# EAGLE design main (EAGLE 4.09)
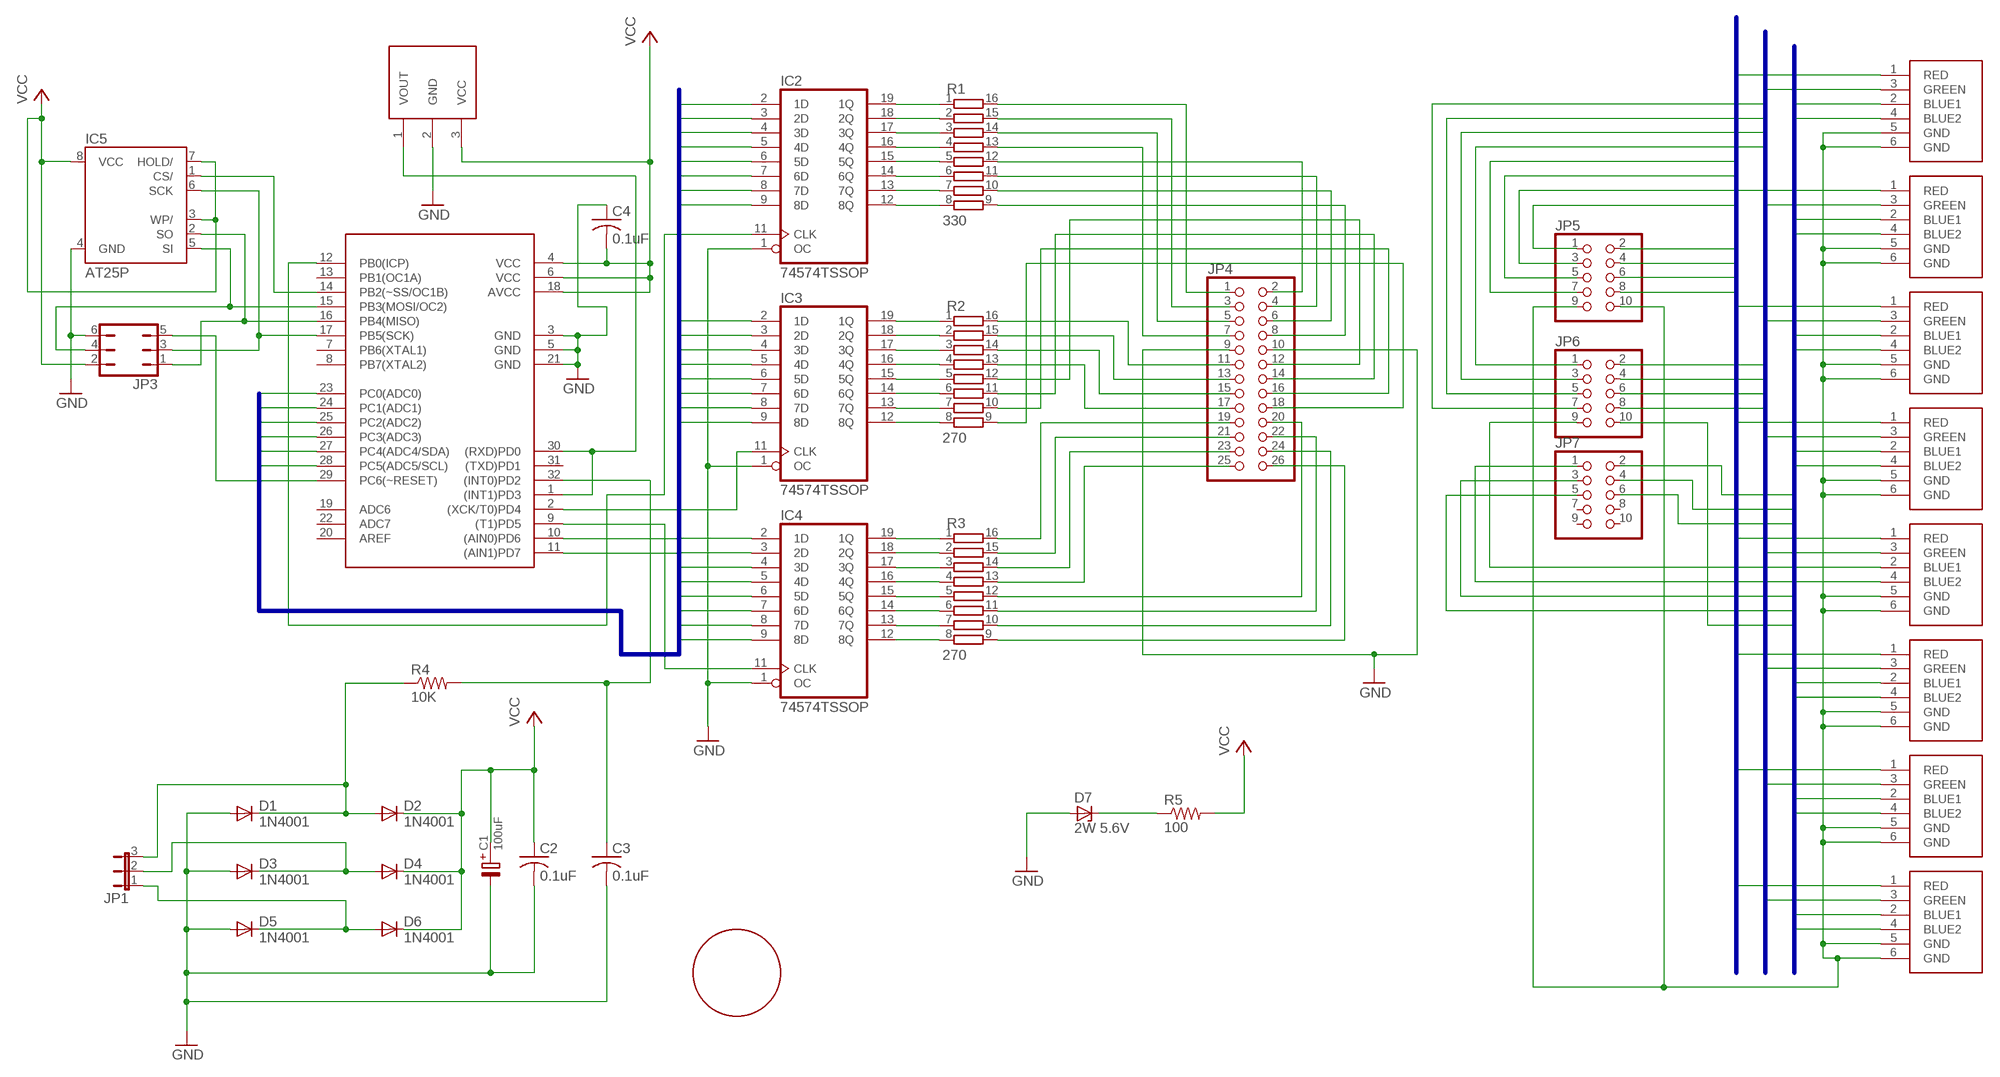
[diagram p0: schematic, sheet 1]

## Parts
C1  100uF  E2,0-5  [E2,0-5]
C2  0.1uF  C-USC1206  [C1206]
C3  0.1uF  C-USC1206  [C1206]
C4  0.1uF  C-USC1206  [C1206]
D1  1N4001  1N4004  [DO41-10]
D2  1N4001  1N4004  [DO41-10]
D3  1N4001  1N4004  [DO41-10]
D4  1N4001  1N4004  [DO41-10]
D5  1N4001  1N4004  [DO41-10]
D6  1N4001  1N4004  [DO41-10]
D7  2W 5.6V  1N4728  [DO41Z10]
GEAR  GEAR-T30  [GEAR-T30]
IC1  ATMEGA8  MEGA8A  [TQFP32]
IC2  74574TSSOP  74574PW  [TSSOP-20]
IC3  74574TSSOP  74574PW  [TSSOP-20]
IC4  74574TSSOP  74574PW  [TSSOP-20]
IC5  AT25P  [DIL08]
JP1  JP2E  [JP2]
JP3  JP3Q  [JP3Q]
JP4  PINHD-2X13  [2X13]
JP5  PINHD-2X5  [2X05]
JP6  PINHD-2X5  [2X05]
JP7  PINHD-2X5  [2X05]
LED0  LF819  [10MM-6]
LED1  LF819  [10MM-6]
LED2  LF819  [10MM-6]
LED3  LF819  [10MM-6]
LED4  LF819  [10MM-6]
LED5  LF819  [10MM-6]
LED6  LF819  [10MM-6]
LED7  LF819  [10MM-6]
Q1  PNA46XXM  [SIP-3]
R1  330  4816P-T01  [4816P]
R2  270  4816P-T01  [4816P]
R3  270  4816P-T01  [4816P]
R4  10K  R-US_R1206  [R1206]
R5  100  R-US_R1206  [R1206]

## Nets
ARM-GND: JP5.9 JP5.10 LED0.5(GND) LED0.6(GND) LED1.5(GND) LED1.6(GND) LED2.5(GND) LED2.6(GND) LED3.5(GND) LED3.6(GND) LED4.5(GND) LED4.6(GND) LED5.5(GND) LED5.6(GND) LED6.5(GND) LED6.6(GND) LED7.5(GND) LED7.6(GND)
B0: JP6.9 LED0.2(BLUE1) LED0.4(BLUE2)
B0-B: JP4.19 R3.16
B1: JP7.1 LED1.2(BLUE1) LED1.4(BLUE2)
B1-B: JP4.21 R3.15
B2: JP7.3 LED2.2(BLUE1) LED2.4(BLUE2)
B2-B: JP4.23 R3.14
B3: JP7.5 LED3.2(BLUE1) LED3.4(BLUE2)
B3-B: JP4.25 R3.13
B4: JP6.10 LED4.2(BLUE1) LED4.4(BLUE2)
B4-B: JP4.20 R3.12
B5: JP7.2 LED5.2(BLUE1) LED5.4(BLUE2)
B5-B: JP4.22 R3.11
B6: JP7.4 LED6.2(BLUE1) LED6.4(BLUE2)
B6-B: JP4.24 R3.10
B7: JP7.6 LED7.2(BLUE1) LED7.4(BLUE2)
B7-B: JP4.26 R3.9
BPRE0: IC4.19(1Q) R3.1
BPRE1: IC4.18(2Q) R3.2
BPRE2: IC4.17(3Q) R3.3
BPRE3: IC4.16(4Q) R3.4
BPRE4: IC4.15(5Q) R3.5
BPRE5: IC4.14(6Q) R3.6
BPRE6: IC4.13(7Q) R3.7
BPRE7: IC4.12(8Q) R3.8
COMM-DATA: IC1.1((INT1)PD3) IC1.30((RXD)PD0) Q1.1(VOUT)
D0: IC1.23(PC0(ADC0)) IC2.2(1D) IC3.2(1D) IC4.2(1D)
D1: IC1.24(PC1(ADC1)) IC2.3(2D) IC3.3(2D) IC4.3(2D)
D2: IC1.25(PC2(ADC2)) IC2.4(3D) IC3.4(3D) IC4.4(3D)
D3: IC1.26(PC3(ADC3)) IC2.5(4D) IC3.5(4D) IC4.5(4D)
D4: IC1.27(PC4(ADC4/SDA)) IC2.6(5D) IC3.6(5D) IC4.6(5D)
D5: IC1.28(PC5(ADC5/SCL)) IC2.7(6D) IC3.7(6D) IC4.7(6D)
D6: IC1.10((AIN0)PD6) IC2.8(7D) IC3.8(7D) IC4.8(7D)
D7: IC1.11((AIN1)PD7) IC2.9(8D) IC3.9(8D) IC4.9(8D)
G0: JP6.1 LED0.3(GREEN)
G0-B: JP4.11 R2.16
G1: JP6.3 LED1.3(GREEN)
G1-B: JP4.13 R2.15
G2: JP6.5 LED2.3(GREEN)
G2-B: JP4.15 R2.14
G3: JP6.7 LED3.3(GREEN)
G3-B: JP4.17 R2.13
G4: JP6.2 LED4.3(GREEN)
G4-B: JP4.12 R2.12
G5: JP6.4 LED5.3(GREEN)
G5-B: JP4.14 R2.11
G6: JP6.6 LED6.3(GREEN)
G6-B: JP4.16 R2.10
G7: JP6.8 LED7.3(GREEN)
G7-B: JP4.18 R2.9
GND: C1.- C2.2 C3.2 C4.1 D1.A D3.A D5.A D7.A IC1.3(GND) IC1.5(GND) IC1.21(GND) IC2.1(OC) IC3.1(OC) IC4.1(OC) IC5.4(GND) JP3.6 JP4.9 JP4.10 Q1.2(GND)
GPRE0: IC3.19(1Q) R2.1
GPRE1: IC3.18(2Q) R2.2
GPRE2: IC3.17(3Q) R2.3
GPRE3: IC3.16(4Q) R2.4
GPRE4: IC3.15(5Q) R2.5
GPRE5: IC3.14(6Q) R2.6
GPRE6: IC3.13(7Q) R2.7
GPRE7: IC3.12(8Q) R2.8
MISO: IC1.16(PB4(MISO)) IC5.2(SO) JP3.1
MOSI: IC1.15(PB3(MOSI/OC2)) IC5.5(SI) JP3.4
N$1: D7.C R5.1
R0: JP5.1 LED0.1(RED)
R0-B: JP4.1 R1.16
R1: JP5.3 LED1.1(RED)
R1-B: JP4.3 R1.15
R2: JP5.5 LED2.1(RED)
R2-B: JP4.5 R1.14
R3: JP5.7 LED3.1(RED)
R3-B: JP4.7 R1.13
R4: JP5.2 LED4.1(RED)
R4-B: JP4.2 R1.12
R5: JP5.4 LED5.1(RED)
R5-B: JP4.4 R1.11
R6: JP5.6 LED6.1(RED)
R6-B: JP4.6 R1.10
R7: JP5.8 LED7.1(RED)
R7-B: JP4.8 R1.9
RESET: IC1.29(PC6(~RESET)) JP3.5
RPRE0: IC2.19(1Q) R1.1
RPRE1: IC2.18(2Q) R1.2
RPRE2: IC2.17(3Q) R1.3
RPRE3: IC2.16(4Q) R1.4
RPRE4: IC2.15(5Q) R1.5
RPRE5: IC2.14(6Q) R1.6
RPRE6: IC2.13(7Q) R1.7
RPRE7: IC2.12(8Q) R1.8
SCK: IC1.17(PB5(SCK)) IC5.6(SCK) JP3.3
SS: IC1.14(PB2(~SS/OC1B)) IC5.1(CS/)
STROBE_BLUE: IC1.9((T1)PD5) IC4.11(CLK)
STROBE_FRAME: C3.1 IC1.32((INT0)PD2) R4.2
STROBE_GREEN: IC1.2((XCK/T0)PD4) IC3.11(CLK)
STROBE_RED: IC1.12(PB0(ICP)) IC2.11(CLK)
VCC: C1.+ C2.1 C4.2 D2.C D4.C D6.C IC1.4(VCC) IC1.6(VCC) IC1.18(AVCC) IC5.3(WP/) IC5.7(HOLD/) IC5.8(VCC) JP3.2 Q1.3(VCC) R5.2
VIN-PHASE1: D5.C D6.A JP1.1
VIN-PHASE2: D3.C D4.A JP1.2
VIN_PHASE3: D1.C D2.A JP1.3 R4.1
Unconnected: IC1.7(PB6(XTAL1)) IC1.8(PB7(XTAL2)) IC1.13(PB1(OC1A)) IC1.19(ADC6) IC1.20(AREF) IC1.22(ADC7) IC1.31((TXD)PD1) JP7.7 JP7.8 JP7.9 JP7.10

## Buses
D[0..7]
R[0..7]
G[0..7]
B[0..7]

## Power pins joined to a net without a drawn wire
GND: IC2.10(GND) IC3.10(GND) IC4.10(GND)
VCC: IC2.20(VCC) IC3.20(VCC) IC4.20(VCC)

## Library data of the parts
C1 = cap-pan:E2,0-5
C2-C4 = rcl:C-US: CAPACITOR, American symbol
D1-D6 = diode:1N4004: DIODE general purpose rectifier, 1 A
D7 = diode:1N4728: Z DIODE 3.3 V, 1W, 5 percent
GEAR = spin:GEAR-T30
IC1 = atmel:MEGA8*: MICROCONTROLLER 8 Kbytes FLASH 1024 bytes SRAM 512 bytes EEPROM USART 8-channel 10 bit ADC
IC2-IC4 = 74xx-us:74*574: 8-bit D type FLIP FLOP bus driver
IC5 = atmel:AT25*: SPI bus serial EEPROM
JP1 = jumper:JP2E: JUMPER
JP3 = jumper:JP3Q: JUMPER
JP4 = pinhead:PINHD-2X13: PIN HEADER
JP5-JP7 = pinhead:PINHD-2X5: PIN HEADER
LED0 LED1-LED7 = kingbright:LF819: Full-color LED, 10MM
Q1 = spin:PNA46XXM
R1-R3 = resistor-bourns:4816P-T01: BOURNS RESISTOR NETWORK
R4 R5 = rcl:R-US_: RESISTOR, American symbol

## Board
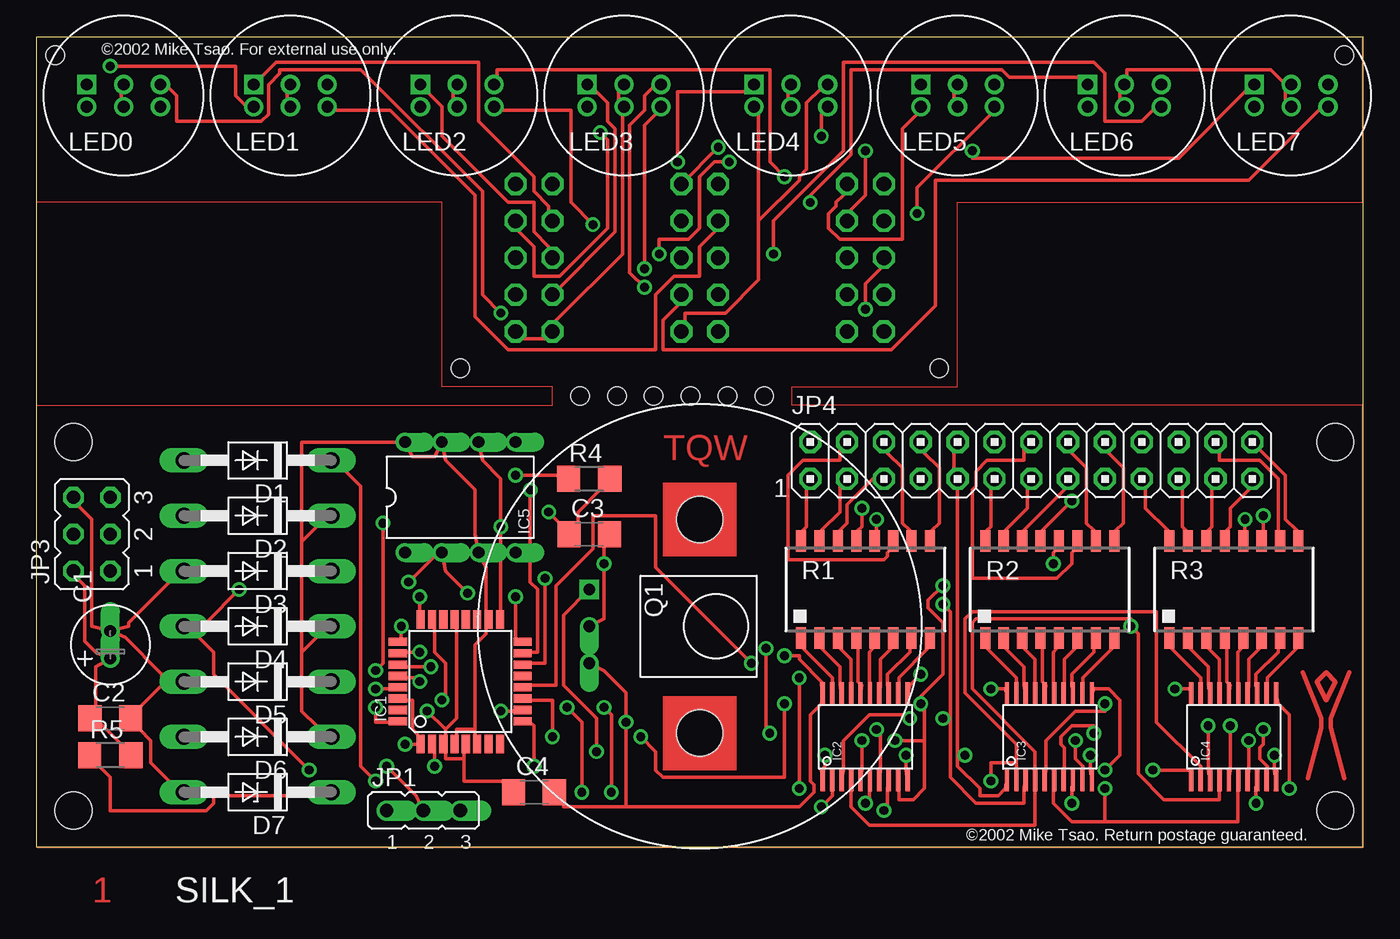
[diagram p1: board, top side]
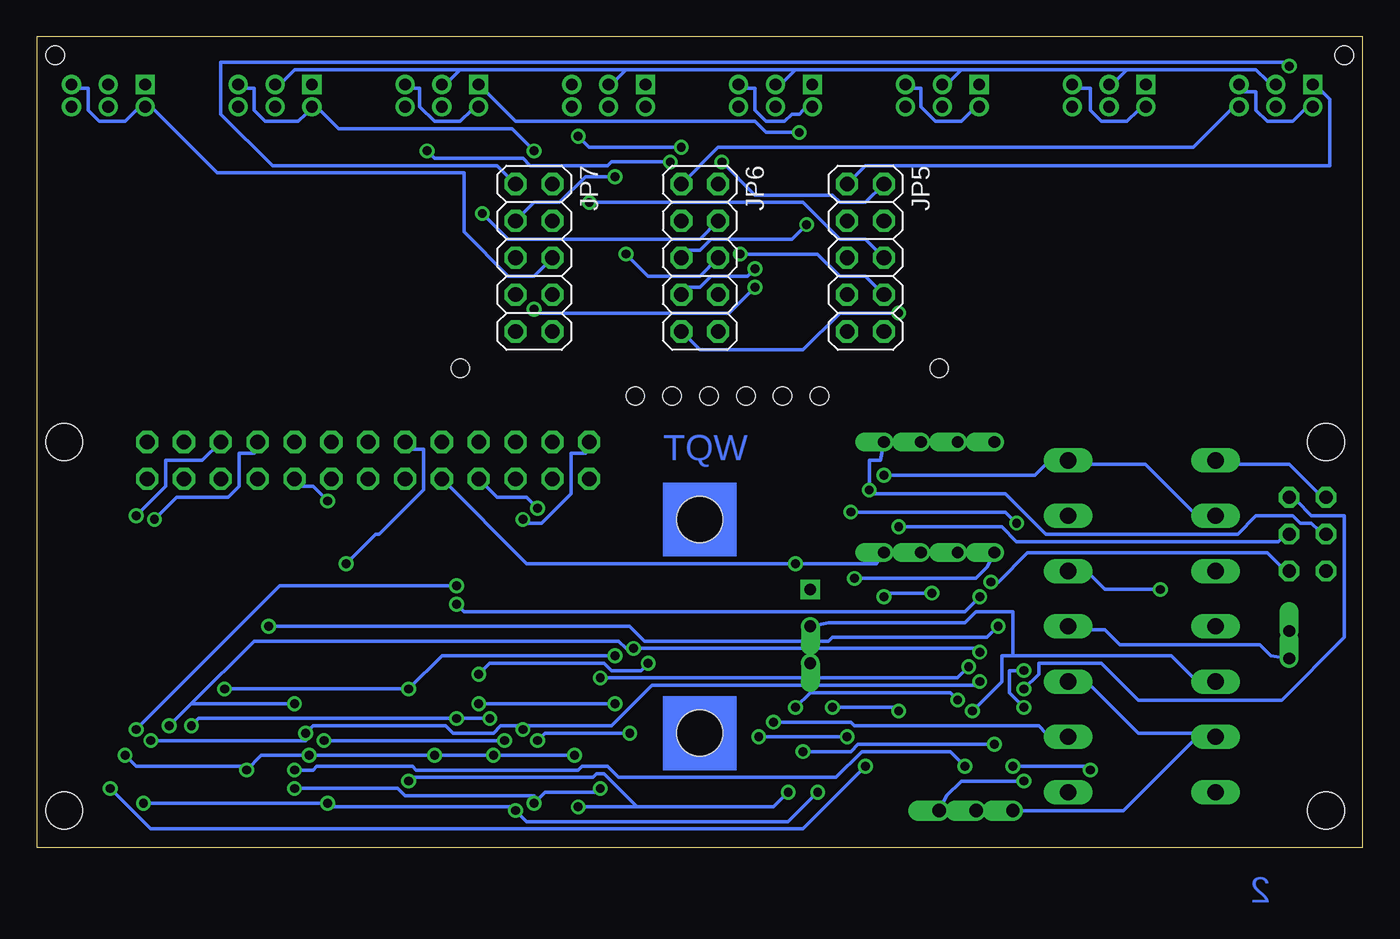
[diagram p2: board, bottom side, seen from below]

Size 91.44 x 55.88 mm. Coordinates in mm from the lower left corner, seen from the top.
Outline: 0,55.88 91.44,55.88 91.44,0 0,0 0,55.88
Copper layers used: Top, Bottom
Holes 1.27 mm at 1.27,54.61 90.17,54.61 50.16,31.11 47.62,31.11 45.09,31.11 42.55,31.11 40.01,31.11 37.47,31.11 29.21,33.02 62.23,33.02
Holes 2.54 mm at 2.54,27.94 2.54,2.54 89.53,2.54 89.53,27.94
tRestrict: area -1.3,29.2 to 91.4,33; area -1.3,35.6 to 29.2,45.7; area 62.2,36.8 to 92.7,45.7
bRestrict: area -1.3,29.2 to 91.4,33; area -1.3,35.6 to 29.2,45.7; area 62.2,36.8 to 92.7,45.7
vRestrict: area -1.3,29.2 to 91.4,33; area 62.2,0 to 87.6,1.3; area -1.3,35.6 to 29.2,45.7; area 62.2,36.8 to 92.7,45.7

### Footprints (pad centres in the part's own frame; a part is rotated, then mirrored left to right if it is on the bottom)
E2,0-5 = drill 0.813 pad 1.27 offset: + -0.953,0; - 0.953,0
C1206 = smd 1.6 x 1.8: 1 -1.4,0; 2 1.4,0
DO41-10 = drill 1.118 long: A 5.08,0; C -5.08,0
DO41Z10 = drill 1.118 long: A 5.08,0; C -5.08,0
GEAR-T30 = hole 3.175: 0,7.366; 0,-7.366
TQFP32 = smd 1.27 x 0.559: 1 -4.293,2.743; 2 -4.293,1.956; 3 -4.293,1.168; 4 -4.293,0.381; 5 -4.293,-0.381; 6 -4.293,-1.168; 7 -4.293,-1.956; 8 -4.293,-2.743; 17 4.293,-2.743; 18 4.293,-1.956; 19 4.293,-1.168; 20 4.293,-0.381; 21 4.293,0.381; 22 4.293,1.168; 23 4.293,1.956; 24 4.293,2.743 | smd 0.559 x 1.27: 9 -2.743,-4.293; 10 -1.956,-4.293; 11 -1.168,-4.293; 12 -0.381,-4.293; 13 0.381,-4.293; 14 1.168,-4.293; 15 1.956,-4.293; 16 2.743,-4.293; 25 2.743,4.293; 26 1.956,4.293; 27 1.168,4.293; 28 0.381,4.293; 29 -0.381,4.293; 30 -1.168,4.293; 31 -1.956,4.293; 32 -2.743,4.293
TSSOP-20 = smd 1.6 x 0.3: 1 -2.95,2.95; 2 -2.95,2.3; 3 -2.95,1.65; 4 -2.95,1; 5 -2.95,0.35; 6 -2.95,-0.3; 7 -2.95,-0.95; 8 -2.95,-1.6; 9 -2.95,-2.25; 10 -2.95,-2.9; 11 2.95,-2.9; 12 2.95,-2.25; 13 2.95,-1.6; 14 2.95,-0.95; 15 2.95,-0.3; 16 2.95,0.35; 17 2.95,1; 18 2.95,1.65; 19 2.95,2.3; 20 2.95,2.95
DIL08 = drill 0.813 offset: 1 -3.81,-3.81; 2 -1.27,-3.81; 3 1.27,-3.81; 4 3.81,-3.81; 5 3.81,3.81; 6 1.27,3.81; 7 -1.27,3.81; 8 -3.81,3.81
JP2 = drill 0.914 offset: 1 -2.54,0; 2 0,0; 3 2.54,0
JP3Q = drill 0.914 octagon: 1 -2.54,-1.27; 2 -2.54,1.27; 3 0,-1.27; 4 0,1.27; 5 2.54,-1.27; 6 2.54,1.27
2X13 = drill 1.016 octagon: 1 -15.24,-1.27; 2 -15.24,1.27; 3 -12.7,-1.27; 4 -12.7,1.27; 5 -10.16,-1.27; 6 -10.16,1.27; 7 -7.62,-1.27; 8 -7.62,1.27; 9 -5.08,-1.27; 10 -5.08,1.27; 11 -2.54,-1.27; 12 -2.54,1.27; 13 0,-1.27; 14 0,1.27; 15 2.54,-1.27; 16 2.54,1.27; 17 5.08,-1.27; 18 5.08,1.27; 19 7.62,-1.27; 20 7.62,1.27; 21 10.16,-1.27; 22 10.16,1.27; 23 12.7,-1.27; 24 12.7,1.27; 25 15.24,-1.27; 26 15.24,1.27
2X05 = drill 1.016 octagon: 1 -5.08,-1.27; 2 -5.08,1.27; 3 -2.54,-1.27; 4 -2.54,1.27; 5 0,-1.27; 6 0,1.27; 7 2.54,-1.27; 8 2.54,1.27; 9 5.08,-1.27; 10 5.08,1.27
10MM-6 = drill 0.813 square: 1 -2.54,0.77 | drill 0.813 round: 2 2.54,0.77; 3 2.54,-0.77; 4 -2.54,-0.77; 5 0,0.77; 6 0,-0.77
SIP-3 = drill 0.813 square: 1 -2.54,0 | drill 0.813 offset: 2 0,0; 3 2.54,0
4816P = smd 0.7 x 1.5: 1 -4.445,-3.346; 2 -3.175,-3.346; 3 -1.905,-3.346; 4 -0.635,-3.346; 5 0.635,-3.346; 6 1.905,-3.346; 7 3.175,-3.346; 8 4.445,-3.346; 9 4.445,3.346; 10 3.175,3.346; 11 1.905,3.346; 12 0.635,3.346; 13 -0.635,3.346; 14 -1.905,3.346; 15 -3.175,3.346; 16 -4.445,3.346
R1206 = smd 1.6 x 1.803: 1 -1.422,0; 2 1.422,0

### Placement (x,y rotation side)
C1  5.08,13.97 90 top
C2  5.08,8.89 0 top
C3  38.1,21.59 0 top
C4  34.29,3.81 0 top
D1  15.24,26.67 180 top
D2  15.24,22.86 180 top
D3  15.24,19.05 180 top
D4  15.24,15.24 180 top
D5  15.24,11.43 180 top
D6  15.24,7.62 180 top
D7  15.24,3.81 180 top
GEAR  45.72,15.24 0 top
IC1  29.21,11.43 90 top
IC2  57.15,7.62 90 top
IC3  69.85,7.62 90 top
IC4  82.55,7.62 90 top
IC5  29.21,24.13 0 top
JP1  26.67,2.54 0 top
JP3  3.81,21.59 90 top
JP4  68.58,26.67 0 top
JP5  34.29,40.64 270 bottom
JP6  45.72,40.64 270 bottom
JP7  57.15,40.64 270 bottom
LED0  6,51.81 0 top
LED1  17.5,51.81 0 top
LED2  29,51.81 0 top
LED3  40.5,51.81 0 top
LED4  52,51.81 0 top
LED5  63.5,51.81 0 top
LED6  75,51.81 0 top
LED7  86.5,51.81 0 top
Q1  38.1,15.24 270 top
R1  57.15,17.78 0 top
R2  69.85,17.78 0 top
R3  82.55,17.78 0 top
R4  38.1,25.4 0 top
R5  5.08,6.35 0 top

### Tracks (layer width: path | path; a pad name or v marks a point on that pad's centre or on a via)
ARM-GND
  Top 0.254: JP5.10 33.53,35.05 35.05,35.05 JP5.9 35.81,36.32 40.39,40.89 40.39,50.55 LED3.6 40.13,51.56 40.13,52.07 LED3.5 | LED7.6 86.11,51.56 86.11,52.07 LED7.5 85.85,52.83 85.09,53.59 75.18,53.59 75.18,53.09 LED6.5 74.68,52.07 74.68,51.56 LED6.6 | LED5.6 63.25,51.56 63.25,52.07 LED5.5 | LED4.6 51.82,51.56 51.82,52.07 LED4.5 | LED2.6 28.7,51.56 28.7,52.07 LED2.5 | LED0.6 5.84,51.56 5.84,52.07 LED0.5 | LED1.6 17.27,51.56 17.27,52.07 LED1.5
  Bottom 0.254: 16.26,53.59 7.37,53.59 6.6,52.83 LED0.5 | 16.26,53.59 17.02,52.83 LED1.5 | 27.69,53.59 28.45,52.83 LED2.5 | 16.26,53.59 27.69,53.59 | 39.12,53.59 39.88,52.83 LED3.5 | 27.69,53.59 39.12,53.59 | 50.8,53.59 51.56,52.83 LED4.5 | 39.12,53.59 50.8,53.59 | 62.23,53.59 62.99,52.83 LED5.5 | 50.8,53.59 62.23,53.59 | 62.23,53.59 73.66,53.59 74.42,52.83 LED6.5
B0  (via drill 0.61)
  Top 0.254: v32,36.83 30.73,38.1 30.73,45.21 22.35,53.59 16.76,53.59 16.76,53.34 16,52.58 16,50.55 15.49,50.04 9.65,50.04 9.65,51.82 9.14,52.32 LED0.2
  Bottom 0.254: LED0.4 4.06,50.8 4.83,50.04 6.6,50.04 7.37,50.8 7.37,52.07 8.13,52.07 LED0.2 | v32,36.83 36.07,36.83 38.61,34.29 45.72,34.29 JP6.9
B0-B
  Top 0.254: R3.16 77.98,21.84 76.45,23.37 76.45,24.64 JP4.19
B1  (via drill 0.61)
  Top 0.254: v5.08,53.85 13.72,53.85 13.72,51.82 14.48,51.05 LED1.4
  Bottom 0.254: LED1.4 15.49,50.8 16.26,50.04 18.03,50.04 18.8,50.8 18.8,52.32 19.56,52.32 LED1.2 | v5.08,53.85 5.33,54.1 78.74,54.1 78.74,50.55 75.18,46.99 59.69,46.99 JP7.1
B1-B
  Top 0.254: R3.15 79.25,21.84 78.99,22.1 78.99,24.64 JP4.21
B2  (via drill 0.61)
  Top 0.254: v51.56,46.23 50.55,47.24 50.55,53.59 31.75,53.59 31.75,53.09 LED2.2
  Bottom 0.254: LED2.4 26.92,50.8 27.69,50.04 29.46,50.04 30.48,51.05 30.48,52.32 30.99,52.32 LED2.2 | v51.56,46.23 53.59,46.23 55.37,44.45 57.15,44.45 JP7.3
B2-B
  Top 0.254: R3.14 80.77,21.84 81.03,22.1 81.03,24.64 JP4.23
B3  (via drill 0.61)
  Top 0.254: v57.15,37.08 57.15,38.86 58.17,39.88 JP7.5 | v41.91,38.61 40.89,39.62 40.89,49.78 41.91,50.8 41.91,51.82 42.42,52.32 LED3.2
  Bottom 0.254: LED3.4 38.61,50.8 38.86,50.55 39.37,50.55 39.88,50.04 41.15,50.04 41.91,50.8 41.91,52.32 42.42,52.32 LED3.2 | v57.15,37.08 56.9,36.83 43.69,36.83 v41.91,38.61
B3-B
  Top 0.254: R3.13 82.04,21.84 82.3,22.1 82.3,23.37 83.57,24.64 JP4.25
B4
  Top 0.254: 49.78,43.18 49.78,39.12 47.5,36.83 44.7,36.83 44.7,36.32 JP6.10 | 49.78,43.18 49.78,50.55 LED4.4 | 49.78,43.18 52.58,45.97 52.58,46.23 53.09,46.74 53.09,51.31 54.1,52.32 LED4.2
B4-B  (via drill 0.61)
  Top 0.254: v83.31,22.61 83.31,21.84 R3.12
  Bottom 0.254: v83.31,22.61 81.79,24.13 78.23,24.13 77.47,24.89 77.47,27.18 76.45,27.18 JP4.20
B5
  Top 0.254: JP7.2 55.63,44.96 55.12,44.45 55.12,44.2 54.61,43.69 54.61,42.67 55.37,41.91 59.69,41.91 59.69,49.53 60.71,50.55 LED5.4
  Bottom 0.254: LED5.4 61.47,50.8 62.23,50.04 64.01,50.04 65.02,51.05 65.02,52.32 65.53,52.32 LED5.2
B5-B  (via drill 0.61)
  Top 0.254: v84.58,22.86 84.58,21.84 R3.11
  Bottom 0.254: v84.58,22.86 82.55,24.89 82.55,26.67 80.01,26.67 JP4.22
B6  (via drill 0.61)
  Top 0.254: v57.15,48.01 57.15,44.96 56.13,43.94 JP7.4
  Bottom 0.254: LED6.2 76.96,52.32 76.45,52.32 76.45,50.8 75.69,50.04 73.41,50.04 72.9,50.55 LED6.4 71.88,50.8 70.61,49.53 58.67,49.53 v57.15,48.01
B6-B
  Top 0.254: R3.10 85.6,21.84 85.6,25.4 84.33,26.67 81.53,26.67 81.53,27.18 JP4.24
B7
  Bottom 0.254: LED7.2 88.39,52.32 87.88,52.32 87.88,50.8 87.12,50.04 85.34,50.04 84.58,50.8 LED7.4 83.31,50.8 78.99,46.48 61.98,46.48 61.98,42.42 58.93,39.37 57.15,39.37 JP7.6
B7-B
  Top 0.254: R3.9 86.87,21.84 86.11,22.61 86.11,25.65 JP4.26
BORDER
  Top 0.025: 91.44,0 91.44,30.48 52.07,30.48 52.07,31.75 63.5,31.75 63.5,44.45 91.44,44.45 91.44,55.88 0,55.88 0,44.45 27.94,44.45 27.94,31.75 35.56,31.75 35.56,30.48 0,30.48 0,0 91.44,0
BPRE0
  Top 0.254: IC4.19 80.26,11.18 80.26,11.68 78.23,13.72 R3.1
BPRE1
  Top 0.254: IC4.18 80.77,11.18 80.77,12.45 79.5,13.72 R3.2
BPRE2
  Top 0.254: IC4.17 81.53,11.18 81.53,12.95 80.77,13.72 R3.3
BPRE3
  Top 0.254: IC4.16 82.3,11.18 82.04,11.43 82.04,13.72 R3.4
BPRE4
  Top 0.254: IC4.15 82.8,11.18 82.8,13.46 83.06,13.72 R3.5
BPRE5
  Top 0.254: IC4.14 83.57,11.18 83.57,12.95 84.33,13.72 R3.6
BPRE6
  Top 0.254: IC4.13 84.07,11.18 84.07,11.94 85.6,13.46 85.6,13.72 R3.7
BPRE7
  Top 0.254: IC4.12 84.84,11.18 84.84,11.68 86.87,13.72 R3.8
COMM-DATA  (via drill 0.61)
  Top 0.254: IC1.30 25.4,10.16 25.91,10.16 25.91,8.13 26.42,7.62 IC1.1 26.42,7.11 v25.4,7.11 | v38.61,6.6 38.61,8.89 36.32,11.18 36.32,16 Q1.1
  Bottom 0.254: v38.61,6.6 35.31,6.6 34.8,7.11 v25.4,7.11
D0  (via drill 0.61)
  Top 0.254: 67.56,5.84 67.56,7.11 64.01,10.67 64.01,15.75 64.52,16.26 77.22,16.26 77.22,8.64 80.26,5.59 80.26,5.33 IC4.2 | 67.56,5.84 67.56,5.33 IC3.2 | v27.94,10.16 28.19,10.41 28.19,12.7 27.43,13.46 27.43,15.24 IC1.23 | v39.12,9.65 39.62,9.14 v39.62,3.81 | v54.1,2.79 54.86,3.56 54.86,4.06 IC2.2 | 67.56,5.84 65.79,5.84 v65.79,4.57
  Bottom 0.254: v27.94,10.16 28.45,10.67 38.1,10.67 v39.12,9.65 | v39.62,3.81 40.64,2.79 50.04,2.79 | 50.04,2.79 v54.1,2.79 | v65.79,4.57 65.53,4.83 53.09,4.83 52.83,5.08 52.32,5.08 50.04,2.79
D1  (via drill 0.61)
  Top 0.254: v26.42,17.27 26.42,16.26 IC1.24 | v62.48,16.76 62.99,16.26 62.99,8.89 | 62.99,8.89 62.99,4.83 64.77,3.05 68.07,3.05 68.07,4.06 IC3.3 | v60.2,8.89 60.2,9.14 57.4,9.14 55.63,7.37 55.63,5.33 IC2.3 | 62.99,8.89 v62.48,8.89 | v80.77,8.38 80.77,5.33 IC4.3
  Bottom 0.254: v26.42,17.27 27.43,16.26 61.98,16.26 v62.48,16.76 | v60.2,8.89 v62.48,8.89 80.26,8.89 v80.77,8.38
D2  (via drill 0.61)
  Top 0.254: IC2.4 56.13,4.06 56.13,2.79 57.4,1.52 68.83,1.52 68.83,4.06 IC3.4 68.83,5.33 68.83,6.6 64.52,10.92 64.52,15.49 64.77,15.75 75.44,15.75 v75.44,15.24 75.95,14.73 75.95,5.08 77.72,3.3 81.53,3.3 81.53,4.06 IC4.4 | v25.15,15.24 25.15,14.22 IC1.25
  Bottom 0.254: v25.15,15.24 25.91,14.48 36.58,14.48 36.83,14.22 49.53,14.22 50.55,15.24 v75.44,15.24
D3  (via drill 0.61)
  Top 0.254: v26.42,13.46 25.4,13.46 IC1.26 | v82.3,8.38 82.3,5.33 IC4.5 | v56.9,7.37 56.9,5.33 IC2.5 | v50.55,7.87 50.29,8.13 v50.29,13.72 | v73.66,9.91 73.66,9.4 71.63,9.4 69.6,7.37 69.6,5.33 IC3.5
  Bottom 0.254: v26.42,13.46 26.67,13.72 v50.29,13.72 50.8,13.72 51.31,14.22 76.45,14.22 80.77,9.91 | 80.77,9.91 v82.3,8.38 | v56.9,7.37 56.39,7.87 v50.55,7.87 | 80.77,9.91 v73.66,9.91
D4  (via drill 0.61)
  Top 0.254: 73.66,1.78 82.8,1.78 82.8,4.06 IC4.6 | 73.66,1.78 71.37,1.78 70.1,3.05 70.1,4.06 IC3.6 | v27.18,12.45 25.4,12.45 IC1.27 | v52.58,11.68 v52.58,4.06 | v57.15,3.05 57.4,3.3 57.4,4.06 IC2.6 | v73.66,4.06 73.66,1.78
  Bottom 0.254: v27.18,12.45 27.94,11.68 v52.58,11.68 | v52.58,4.06 52.83,3.81 56.39,3.81 v57.15,3.05 57.15,3.56 66.04,3.56 66.55,4.06 v73.66,4.06
D5  (via drill 0.61)
  Top 0.254: v26.42,11.43 26.42,11.68 25.4,11.68 IC1.28 | v57.91,8.13 58.17,7.87 58.17,5.33 IC2.7 | v72.9,7.87 72.9,8.38 71.37,8.38 70.61,7.62 70.61,7.11 70.87,6.86 70.87,5.33 IC3.7 | v83.57,7.37 83.57,5.33 IC4.7
  Bottom 0.254: v26.42,11.43 26.67,11.18 49.02,11.18 51.82,8.38 57.66,8.38 v57.91,8.13 58.17,8.38 59.44,8.38 59.94,7.87 62.74,7.87 63.25,8.38 72.39,8.38 v72.9,7.87 72.9,7.37 v83.57,7.37
D6  (via drill 0.61)
  Top 0.254: v32,9.4 33.02,9.4 IC1.10 | v36.58,9.65 37.59,8.64 v37.59,3.81 | v58.42,2.54 58.67,2.79 58.67,4.06 IC2.8 | v71.37,3.05 71.37,4.06 IC3.8 | v84.07,3.05 84.07,4.06 IC4.8
  Bottom 0.254: v32,9.4 32.26,9.65 v36.58,9.65 | v37.59,3.81 39.62,1.78 57.66,1.78 v58.42,2.54 58.67,2.79 71.12,2.79 v71.37,3.05 v84.07,3.05
D7  (via drill 0.61)
  Top 0.254: v35.56,7.62 35.56,10.16 34.04,10.16 IC1.11 | v41.66,7.62 42.67,6.6 42.67,5.33 43.18,4.83 51.56,4.83 v51.56,9.91 | 61.21,7.37 61.21,4.06 60.45,3.3 59.44,3.3 59.44,4.06 IC2.9 | 61.21,7.37 61.21,9.65 v60.96,9.91 60.96,10.41 62.48,11.94 62.48,15.49 61.47,16.51 61.47,17.02 v62.48,18.03 | v71.63,7.37 71.63,6.1 72.14,5.59 72.14,5.33 IC3.9 | 61.21,7.37 v59.18,7.37 | v84.58,8.13 84.58,7.11 84.33,6.86 84.33,6.1 84.84,5.59 84.84,5.33 IC4.9
  Bottom 0.254: v35.56,7.62 v41.66,7.62 | v51.56,9.91 v60.96,9.91 | v59.18,7.37 v71.63,7.37 | v84.58,8.13 74.68,18.03 v62.48,18.03
G0
  Bottom 0.254: LED0.3 9.14,50.8 11.68,48.26 44.45,48.26 JP6.1
G0-B
  Top 0.254: R2.16 65.53,21.84 65.79,22.1 65.79,24.64 JP4.11
G1
  Top 0.254: LED1.3 20.57,50.8 24.38,50.8 30.23,44.96 30.23,36.58 32.51,34.29 42.67,34.29 42.67,38.1 43.94,39.37 45.72,39.37 45.72,41.4 46.74,42.42 JP6.3
G1-B
  Top 0.254: R2.15 66.8,21.84 68.33,23.37 68.33,24.64 JP4.13
G2  (via drill 0.61)
  Top 0.254: v38.35,42.93 36.83,44.45 36.83,50.8 32,50.8 LED2.3
  Bottom 0.254: v38.35,42.93 39.37,41.91 44.96,41.91 45.72,41.15 46.48,41.15 JP6.5
G2-B
  Top 0.254: R2.14 68.07,21.84 70.87,24.64 JP4.15
G3  (via drill 0.61)
  Top 0.254: v41.91,39.88 41.91,49.78 42.67,50.55 LED3.3
  Bottom 0.254: v41.91,39.88 42.42,39.37 44.96,39.37 45.72,38.61 46.48,38.61 JP6.7
G3-B  (via drill 0.61)
  Top 0.254: v71.37,23.88 69.34,21.84 R2.13
  Bottom 0.254: v71.37,23.88 72.39,24.89 73.15,24.89 JP4.17
G4  (via drill 0.61)
  Top 0.254: v54.1,49.02 54.1,50.55 LED4.3 | JP6.2 v46.99,48.26
  Bottom 0.254: v54.1,49.02 53.34,48.26 v46.99,48.26
G4-B  (via drill 0.61)
  Top 0.254: v70.1,19.56 70.1,20.32 70.36,20.57 R2.12
  Bottom 0.254: v70.1,19.56 68.07,21.59 67.82,21.59 64.77,24.64 64.77,27.43 65.53,27.43 JP4.12
G5  (via drill 0.61)
  Top 0.254: v60.71,43.69 60.71,45.47 65.79,50.55 LED5.3
  Bottom 0.254: v60.71,43.69 58.93,41.91 45.72,41.91 JP6.4
G5-B
  Top 0.254: R2.11 71.63,20.57 71.37,20.32 71.37,19.56 70.36,18.54 64.52,18.54 64.52,24.64 64.77,24.89 64.77,25.91 65.53,26.67 68.07,26.67 68.07,27.43 JP4.14
G6  (via drill 0.61)
  Top 0.254: v50.8,40.89 50.8,43.18 55.63,48.01 55.63,54.1 72.9,54.1 73.66,53.34 73.66,50.04 76.2,50.04 76.96,50.8 LED6.3
  Bottom 0.254: v50.8,40.89 49.28,39.37 45.72,39.37 JP6.6
G6-B
  Top 0.254: R2.10 72.9,21.84 72.39,22.35 72.39,26.16 71.37,27.18 JP4.16
G7
  Top 0.254: LED7.3 88.39,50.8 83.57,45.97 61.98,45.97 61.98,37.34 58.93,34.29 43.18,34.29 43.18,36.32 44.2,37.34 JP6.8
G7-B
  Top 0.254: R2.9 74.42,21.84 74.93,22.35 74.93,26.16 73.91,27.18 JP4.18
GND  (via drill 0.61)
  Top 0.254: 29.46,6.1 28.19,6.1 28.19,6.6 IC1.3 28.19,7.62 28.19,8.13 | 29.46,6.1 29.46,6.6 IC1.5 | 28.19,8.13 28.96,8.89 28.96,15.24 IC1.21 | 29.46,6.1 29.46,4.57 32.26,4.57 C4.1 | D7.A 9.14,4.57 7.87,5.84 7.87,7.37 7.11,8.13 C2.2 7.11,9.65 8.64,11.18 D5.A 8.64,11.68 8.64,11.94 6.1,14.48 C1.- | D3.A 9.14,18.29 6.35,15.49 6.35,15.24 C1.- | JP3.6 2.79,23.62 3.81,22.61 3.81,15.24 C1.- | v26.92,9.4 28.19,8.13 | v54.36,6.35 54.36,5.59 54.1,5.33 IC2.1 | v59.94,6.35 59.94,5.33 IC2.10 | v72.64,6.35 72.64,5.33 IC3.10 | v76.96,5.33 79.5,5.33 IC4.1 | v85.34,6.35 85.34,5.33 IC4.10 | Q1.2 39.12,15.75 v39.12,19.56 39.12,20.83 C3.2 | 63.5,6.35 63.5,5.59 65.02,4.06 65.02,3.56 66.29,3.56 66.8,4.06 IC3.1 | 63.5,6.35 JP4.9 63.25,26.16 63.25,27.18 JP4.10 | 63.5,6.35 v64.01,6.35
  Bottom 0.254: JP3.6 3.05,24.38 5.08,26.42 8.64,26.42 D1.A | v26.92,9.4 24.89,11.43 24.89,13.21 24.13,13.21 | 24.13,13.21 13.21,13.21 11.68,11.68 D5.A | v54.36,6.35 v59.94,6.35 v64.01,6.35 v72.64,6.35 75.95,6.35 v76.96,5.33 77.22,5.59 84.58,5.59 v85.34,6.35 | IC5.4 33.53,19.56 v39.12,19.56 57.66,19.56 JP4.9 | 24.13,13.21 24.13,16.26 26.67,16.26 27.43,15.49 36.83,15.49 Q1.2
GPRE0
  Top 0.254: IC3.19 67.56,11.18 67.56,11.68 65.53,13.72 R2.1
GPRE1
  Top 0.254: IC3.18 68.07,11.18 68.07,12.45 66.8,13.72 R2.2
GPRE2
  Top 0.254: IC3.17 68.83,11.18 68.83,12.95 68.07,13.72 R2.3
GPRE3
  Top 0.254: IC3.16 69.6,11.18 69.34,11.43 69.34,13.72 R2.4
GPRE4
  Top 0.254: IC3.15 70.1,11.18 70.1,13.46 70.36,13.72 R2.5
GPRE5
  Top 0.254: IC3.14 70.87,11.18 70.87,12.95 71.63,13.72 R2.6
GPRE6
  Top 0.254: IC3.13 71.37,11.18 71.37,11.94 72.9,13.46 72.9,13.72 R2.7
GPRE7
  Top 0.254: IC3.12 72.14,11.18 72.14,11.68 74.17,13.72 R2.8
MISO  (via drill 0.61)
  Top 0.254: v33.02,17.27 33.02,14.22 IC1.16 | v29.72,17.53 28.19,19.05 IC5.2 27.43,20.07 v25.65,18.29
  Bottom 0.254: v33.02,17.27 32.77,17.53 v29.72,17.53 | v25.65,18.29 25.15,18.29 23.11,20.32 6.6,20.32 5.59,19.3 JP3.1
MOSI  (via drill 0.61)
  Top 0.254: v34.04,24.64 34.04,18.29 34.54,17.78 34.54,13.46 34.04,13.46 IC1.15
  Bottom 0.254: IC5.5 33.27,26.67 34.04,26.67 v34.04,24.64 33.78,24.38 24.64,24.38 21.84,21.59 8.64,21.59 7.37,22.86 4.83,22.86 4.32,22.35 3.56,22.35 3.05,21.84 JP3.4
N$1
  Top 0.254: D7.C 18.8,3.56 12.19,3.56 12.19,3.05 11.68,2.54 5.08,2.54 5.08,4.83 4.32,5.59 R5.1
N$2
  Top 0.305: 88.9,12.06 88.27,11.43 88.9,10.16 89.53,11.43 88.9,12.06
N$5
  Top 0.305: 90.49,12.06 89.22,8.89 89.22,8.26 90.17,4.76
N$6
  Top 0.305: 87.31,12.06 88.58,8.89 88.58,8.26 87.63,4.76
R0
  Bottom 0.254: LED0.1 3.05,52.07 2.79,52.07 2.29,51.56 2.29,46.99 34.29,46.99 JP5.1
R0-B
  Top 0.254: R1.16 52.83,21.84 53.09,22.1 53.09,24.64 JP4.1
R1
  Top 0.254: LED1.1 15.49,53.09 16.51,54.1 30.48,54.1 30.48,50.04 34.29,46.23 34.29,45.21 35.31,44.2 35.31,43.94 JP5.3
R1-B
  Top 0.254: R1.15 54.1,21.84 55.37,23.11 55.37,24.89 JP4.3
R2
  Top 0.254: LED2.1 26.92,52.07 27.94,51.05 27.94,49.02 32.51,44.45 34.29,44.45 34.29,42.42 35.31,41.4 JP5.5
R2-B
  Top 0.254: R1.14 55.37,21.84 55.88,22.35 55.88,23.62 57.91,25.65 JP4.5
R3
  Top 0.254: LED3.1 38.61,52.07 39.37,51.31 39.37,50.04 39.88,49.53 39.88,42.42 JP5.7
R3-B  (via drill 0.61)
  Top 0.254: v56.9,23.37 56.9,22.1 56.64,21.84 R1.13
  Bottom 0.254: v56.9,23.37 57.66,24.13 59.69,24.13 JP4.7
R4  (via drill 0.61)
  Top 0.254: v44.2,47.24 44.2,52.07 49.02,52.07 LED4.1
  Bottom 0.254: v44.2,47.24 41.91,44.96 36.58,44.96 36.07,44.45 34.29,44.45 JP5.2
R4-B  (via drill 0.61)
  Top 0.254: v57.91,22.61 57.91,21.84 R1.12
  Bottom 0.254: v57.91,22.61 57.66,22.35 56.64,22.35 54.61,24.38 54.61,27.18 53.59,27.18 JP4.2
R5  (via drill 0.61)
  Top 0.254: v38.86,49.28 39.37,48.77 39.37,42.67 36.07,39.37 34.29,39.37 34.29,41.4 33.27,42.42 JP5.4
  Bottom 0.254: v38.86,49.28 41.15,49.28 41.91,50.04 58.42,50.04 60.45,52.07 LED5.1
R5-B
  Top 0.254: R1.11 58.93,20.57 58.67,20.32 58.67,20.07 58.42,19.81 51.82,19.81 51.82,25.65 52.83,26.67 55.37,26.67 55.37,27.43 JP4.4
R6  (via drill 0.61)
  Top 0.254: v53.34,44.45 53.34,44.96 56.13,47.75 56.13,53.59 66.55,53.59 67.06,53.09 71.88,53.09 LED6.1
  Bottom 0.254: v53.34,44.45 38.61,44.45 36.07,41.91 34.29,41.91 JP5.6
R6-B
  Top 0.254: R1.10 60.2,21.84 59.69,22.35 59.69,26.16 58.67,27.18 JP4.6
R7  (via drill 0.61)
  Top 0.254: v64.52,48.01 64.52,47.5 78.74,47.5 83.31,52.07 LED7.1 | v47.75,47.24 46.74,47.24 45.72,46.23 45.72,42.67 44.96,41.91 42.93,41.91 v42.93,40.89
  Bottom 0.254: v64.52,48.01 64.01,47.5 57.91,47.5 57.4,46.99 52.07,46.99 51.82,47.24 v47.75,47.24 | v42.93,40.89 37.59,40.89 36.07,39.37 34.29,39.37 JP5.8
R7-B
  Top 0.254: R1.9 61.72,21.84 62.23,22.35 62.23,26.16 61.21,27.18 JP4.8
RESET  (via drill 0.61)
  Top 0.254: v23.37,10.92 24.38,10.92 IC1.29
  Bottom 0.254: v23.37,10.92 22.35,11.94 22.35,12.7 18.03,12.7 15.49,10.16 5.59,10.16 1.27,14.48 1.27,22.86 3.56,22.86 4.57,23.88 JP3.5
RPRE0
  Top 0.254: IC2.19 54.86,11.18 54.86,11.68 52.83,13.72 R1.1
RPRE1
  Top 0.254: IC2.18 55.37,11.18 55.37,12.45 54.1,13.72 R1.2
RPRE2
  Top 0.254: IC2.17 56.13,11.18 56.13,12.95 55.37,13.72 R1.3
RPRE3
  Top 0.254: IC2.16 56.9,11.18 56.64,11.43 56.64,13.72 R1.4
RPRE4
  Top 0.254: IC2.15 57.4,11.18 57.4,13.46 57.66,13.72 R1.5
RPRE5
  Top 0.254: IC2.14 58.17,11.18 58.17,12.95 58.93,13.72 R1.6
RPRE6
  Top 0.254: IC2.13 58.67,11.18 58.67,11.94 60.2,13.46 60.2,13.72 R1.7
RPRE7
  Top 0.254: IC2.12 59.44,11.18 59.44,11.68 61.47,13.72 R1.8
SCK  (via drill 0.61)
  Top 0.254: IC1.17 32,16.26 v32,22.1 32,25.4 30.73,26.67 IC5.6
  Bottom 0.254: v32,22.1 24.89,22.1 23.88,21.08 5.84,21.08 5.59,21.34 JP3.3
SS  (via drill 0.61)
  Top 0.254: v35.05,18.54 35.05,12.7 34.04,12.7 IC1.14
  Bottom 0.254: v35.05,18.54 26.67,18.54 25.91,19.3 IC5.1
STROBE_BLUE  (via drill 0.61)
  Top 0.254: v34.29,5.59 34.29,8.38 34.04,8.64 IC1.9 | v86.36,4.06 86.36,9.14 85.6,9.91 IC4.11
  Bottom 0.254: v34.29,5.59 38.61,1.27 83.57,1.27 v86.36,4.06
STROBE_FRAME  (via drill 0.61)
  Top 0.254: v23.37,9.65 23.37,8.64 24.38,8.64 IC1.32 | v23.37,12.19 23.88,12.7 v23.88,22.35 | v35.31,23.11 36.07,22.35 C3.1 37.34,22.35 37.34,23.11 38.86,24.64 R4.2
  Bottom 0.254: v23.37,9.65 24.38,10.67 24.38,12.19 v23.37,12.19 | v23.88,22.35 24.64,23.11 v35.31,23.11
STROBE_GREEN  (via drill 0.61)
  Top 0.254: v27.43,5.59 27.43,6.6 IC1.2 | v73.66,5.33 74.68,6.35 74.68,10.16 73.91,10.92 72.9,10.92 IC3.11
  Bottom 0.254: v27.43,5.59 28.45,6.6 34.54,6.6 36.32,4.83 51.31,4.83 52.07,5.59 53.85,5.59 54.1,5.33 65.28,5.33 65.53,5.59 72.14,5.59 72.39,5.33 v73.66,5.33
STROBE_RED  (via drill 0.61)
  Top 0.254: v49.28,12.7 42.67,19.3 42.67,22.86 38.35,22.86 38.35,20.57 35.81,18.03 35.81,11.18 34.04,11.18 IC1.12 | v60.96,11.94 60.2,11.18 IC2.11
  Bottom 0.254: v49.28,12.7 49.78,12.19 51.82,12.19 52.32,12.7 60.2,12.7 v60.96,11.94
VCC  (via drill 0.61)
  Top 0.254: 30.23,8.13 28.96,8.13 28.96,7.62 IC1.4 | 30.23,8.13 30.23,7.62 IC1.6 | 30.23,8.13 30.23,13.97 30.99,14.73 30.99,15.24 IC1.18 30.99,16.26 30.99,19.3 IC5.3 30.23,21.59 30.23,24.64 28.19,26.67 IC5.7 27.43,26.92 25.91,26.92 IC5.8 18.29,27.94 18.29,21.08 | JP3.2 2.79,18.54 3.3,18.03 3.3,14.22 4.06,13.46 C1.+ 4.06,12.45 4.06,9.65 C2.1 4.32,8.64 5.84,7.11 R5.2 | 18.29,13.46 18.29,9.4 19.3,8.38 D6.C | 18.29,13.46 19.3,14.48 D4.C | 18.29,21.08 19.3,22.1 D2.C | 18.29,13.46 18.29,21.08 | v65.79,10.92 66.8,10.92 IC3.20 | v78.49,10.92 79.5,10.92 IC4.20 | 40.64,2.79 36.32,2.79 36.32,3.05 C4.2 | 40.64,2.79 52.58,2.79 53.59,3.81 53.59,4.32 53.34,4.57 53.34,9.14 54.1,9.91 IC2.20 54.1,11.18 54.1,11.43 52.58,12.95 52.58,13.21 v51.56,13.21 | 40.64,2.79 v40.64,8.64 40.64,10.67 39.12,12.19 Q1.3
  Bottom 0.254: C1.+ 6.35,13.21 7.11,13.97 16.76,13.97 17.78,14.99 18.8,14.99 D4.C | v78.49,10.92 v65.79,10.92 63.5,13.21 v51.56,13.21 | v40.64,8.64 35.31,8.64 35.05,8.38 22.35,8.38 21.84,7.87 D6.C
VIN-PHASE1
  Bottom 0.254: JP1.1 16.51,2.54 11.68,7.37 D6.A 11.68,7.87 15.49,7.87 18.8,11.18 D5.C
VIN-PHASE2  (via drill 0.61)
  Top 0.254: v24.13,5.59 26.16,3.56 JP1.2 | v18.8,5.33 12.19,11.94 12.19,13.46 11.18,14.48 D4.A 11.68,15.49 v13.97,17.78
  Bottom 0.254: v24.13,5.59 19.05,5.59 v18.8,5.33 | v13.97,17.78 17.78,17.78 18.8,18.8 D3.C
VIN_PHASE3  (via drill 0.61)
  Top 0.254: v23.37,4.57 22.35,5.59 22.35,24.89 21.34,25.91 D1.C | v33.02,25.65 36.07,25.65 R4.1
  Bottom 0.254: v23.37,4.57 27.69,4.57 28.7,3.56 JP1.3 | D2.A 11.68,23.11 14.99,26.42 18.8,26.42 D1.C 21.84,26.42 22.61,25.65 v33.02,25.65

### Text on the board
Top: TQW | 1
Bottom: TQW | 2
tPlace: ©2002 Mike Tsao. For external use only. | ©2002 Mike Tsao. Return postage guaranteed. | SILK_1
tStop: MASK_1
bStop: MASK_2